# EAGLE design mono.stereo.mixer.noninv (EAGLE 9.6.2)
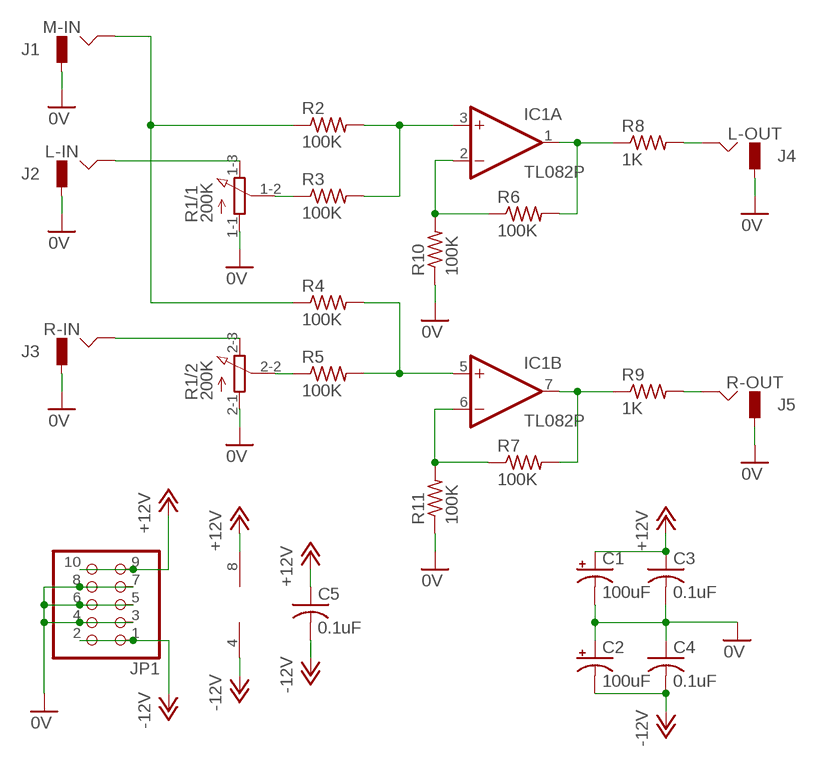
[diagram p0: schematic, sheet 1]

## Parts
C1  100uF  CPOL-USE2-5  [E2-5]
C2  100uF  CPOL-USE2-5  [E2-5]
C3  0.1uF  C-US025-024X044  [C025-024X044]
C4  0.1uF  C-US025-024X044  [C025-024X044]
C5  0.1uF  C-US025-024X044  [C025-024X044]
IC1  TL082P  [DIL08]
J1  M-IN  JACK-M  [JACK-M]
J2  L-IN  JACK-M  [JACK-M]
J3  R-IN  JACK-M  [JACK-M]
J4  L-OUT  JACK-M  [JACK-M]
J5  R-OUT  JACK-M  [JACK-M]
JP1  PINHD-2X5  [2X05]
R1  200K  3RP/1610G  [3RP/1610G]
R2  100K  R-US_0204/5  [0204/5]
R3  100K  R-US_0204/5  [0204/5]
R4  100K  R-US_0204/5  [0204/5]
R5  100K  R-US_0204/5  [0204/5]
R6  100K  R-US_0204/5  [0204/5]
R7  100K  R-US_0204/5  [0204/5]
R8  1K  R-US_0204/5  [0204/5]
R9  1K  R-US_0204/5  [0204/5]
R10  100K  R-US_0204/5  [0204/5]
R11  100K  R-US_0204/5  [0204/5]

## Nets
0V: C1.- C2.+ C3.2 C4.1 J1.GND J2.GND J3.GND J4.GND J5.GND JP1.3 JP1.4 JP1.5 JP1.6 JP1.7 JP1.8 R1.1-1(/1:A) R1.2-1(/2:A) R10.1 R11.1
+12V: C1.+ C3.1 C5.1 IC1.8(P:V+) JP1.9 JP1.10
-12V: C2.- C4.2 C5.2 IC1.4(P:V-) JP1.1 JP1.2
N$1: IC1.2(A:-IN) R6.1 R10.2
N$3: IC1.6(B:-IN) R7.1 R11.2
N$4: J1.HOT R2.1 R4.1
N$5: IC1.3(A:+IN) R2.2 R3.2
N$6: IC1.5(B:+IN) R4.2 R5.2
N$7: IC1.1(A:OUT) R6.2 R8.1
N$8: J4.HOT R8.2
N$9: IC1.7(B:OUT) R7.2 R9.1
N$10: J5.HOT R9.2
N$11: J2.HOT R1.1-3(/1:E)
N$12: J3.HOT R1.2-3(/2:E)
N$13: R1.2-2(/2:S) R5.1
N$14: R1.1-2(/1:S) R3.1

## Library data of the parts
C1 C2 = rcl:CPOL-US: POLARIZED CAPACITOR, American symbol; SPICEPREFIX: C
C3-C5 = rcl:C-US: CAPACITOR, American symbol; SPICEPREFIX: C
IC1 = linear:TL082: OP AMP Data sheet <http://www.ti.com/lit/ds/symlink/tl084a . pdf>; DATA_SHEET: <a href="http://www.ti.com/lit/ds/symlink/tl084a.pdf"> Data sheet </a>
J1-J5 = _common:JACK-M
JP1 = pinhead:PINHD-2X5: PIN HEADER
R1 = _common:3RP/1610G: Generic two level pot.
R2-R11 = rcl:R-US_: RESISTOR, American symbol; SPICEPREFIX: R

## Board
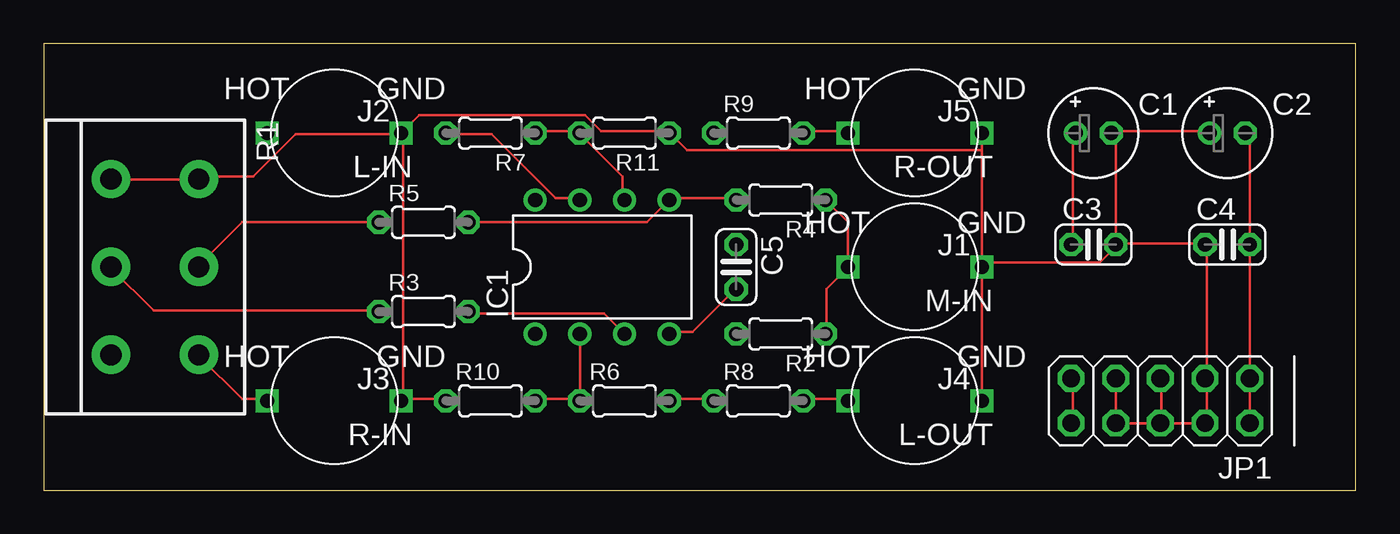
[diagram p1: board, top side]
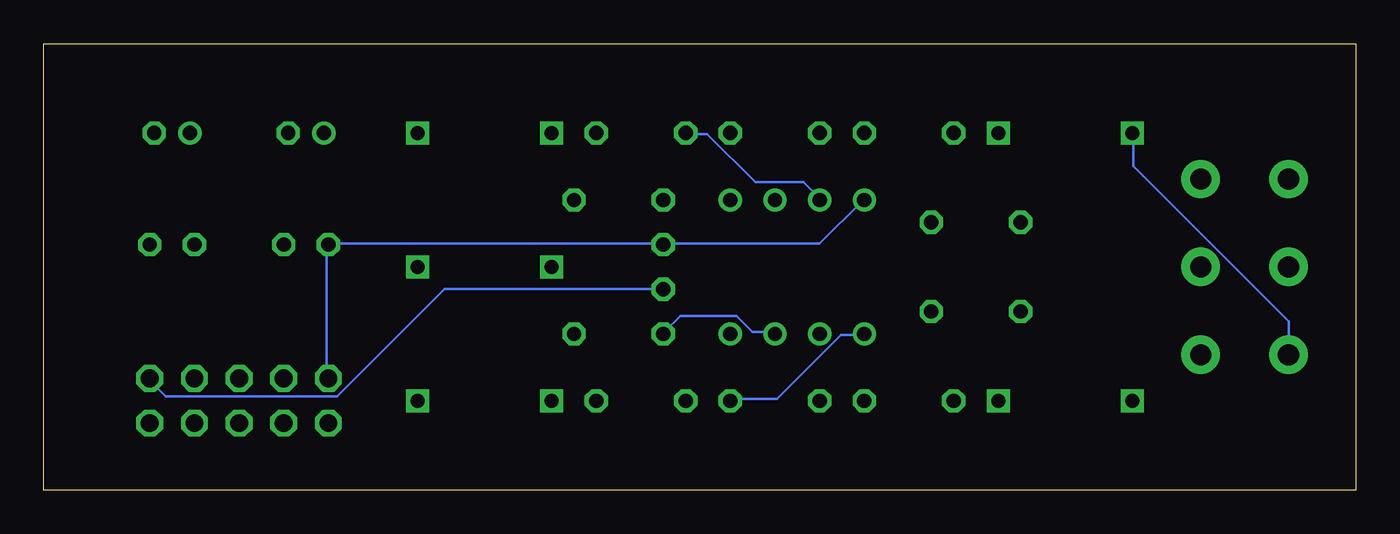
[diagram p2: board, bottom side, seen from below]

Size 74.6 x 25.39 mm. Coordinates in mm from the lower left corner, seen from the top.
Outline: 0,0 74.6,0 74.6,25.39 0,25.39 0,0
Copper layers (1*16): Top 0.035mm / dielectric 1.5mm / Bottom 0.035mm
Design rules "default": minimum track width 6mil, minimum drill 0.35mm, track to track 6mil, track to pad 6mil, pad to pad 6mil, via to via 6mil, smd to smd 6mil, copper to edge 40mil, drill to drill 6mil, minimum pad ring 10mil, minimum via ring 8mil, stop-mask expansion 4mil, vias tented up to drill 0mil, thermal gap 10mil

### Footprints (pad centres in the part's own frame; a part is rotated, then mirrored left to right if it is on the bottom)
E2-5 = drill 0.813 pad 1.27: + -1.016,0 | drill 0.813 pad 1.27 octagon: - 1.016,0
C025-024X044 = drill 0.813 octagon: 1 -1.27,0; 2 1.27,0
DIL08 = drill 0.813 pad 1.27: 1 -3.81,-3.81; 2 -1.27,-3.81; 3 1.27,-3.81; 4 3.81,-3.81; 5 3.81,3.81; 6 1.27,3.81; 7 -1.27,3.81; 8 -3.81,3.81
JACK-M = drill 0.8 square: GND -3.81,0; HOT 3.81,0
2X05 = drill 1.016 octagon: 1 -5.08,-1.27; 2 -5.08,1.27; 3 -2.54,-1.27; 4 -2.54,1.27; 5 0,-1.27; 6 0,1.27; 7 2.54,-1.27; 8 2.54,1.27; 9 5.08,-1.27; 10 5.08,1.27
3RP/1610G = drill 1.2 pad 2.184: 1-1 -5,0; 1-2 0,0; 1-3 5,0; 2-1 -5,5; 2-2 0,5; 2-3 5,5
0204/5 = drill 0.813 octagon: 1 -2.54,0; 2 2.54,0

### Placement (x,y rotation side)
C1  59.69,20.32 0 top
C2  67.31,20.32 0 top
C3  59.69,13.97 0 top
C4  67.31,13.97 0 top
C5  39.37,12.7 270 top
IC1  31.75,12.7 0 top
J1  49.53,12.7 180 top
J2  16.51,20.32 180 top
J3  16.51,5.08 180 top
J4  49.53,5.08 180 top
J5  49.53,20.32 180 top
JP1  63.5,5.08 180 top
R1  3.81,12.7 270 top
R2  41.91,8.89 180 top
R3  21.59,10.16 0 top
R4  41.91,16.51 180 top
R5  21.59,15.24 0 top
R6  33.02,5.08 0 top
R7  25.4,20.32 180 top
R8  40.64,5.08 0 top
R9  40.64,20.32 0 top
R10  25.4,5.08 0 top
R11  33.02,20.32 180 top

### Tracks (layer width: path | path; a pad name or v marks a point on that pad's centre or on a via)
0V
  Top 0.152: J1.GND J4.GND | J1.GND 53.34,12.95 | 53.34,12.95 53.34,19.36 | 53.34,19.36 J5.GND | JP1.7 JP1.8 JP1.6 63.55,3.81 | 63.55,3.81 63.55,6.25 JP1.5 | 63.55,3.81 JP1.4 66.14,3.81 66.14,6.25 JP1.3 66.14,6.4 66.14,13.87 C4.1 65.99,14.02 60.96,14.02 | 60.96,20.42 66.29,20.42 C2.+ | 60.96,20.42 60.81,20.42 C1.- 60.96,20.42 | 60.96,20.42 60.96,14.02 | 60.96,14.02 C3.2 60.96,13.87 60.05,12.95 53.34,12.95 | 53.34,12.8 J1.GND | 20.42,5.18 22.86,5.18 R10.1 | J2.GND 20.27,20.27 14.33,20.27 11.89,17.83 8.84,17.83 R1.2-1 8.69,17.68 3.81,17.68 R1.1-1 | J2.GND 21.34,21.34 30.79,21.34 31.7,20.42 35.51,20.42 R11.1 35.66,20.27 36.58,19.36 53.34,19.36 | 20.42,5.18 20.42,20.27 J2.GND | 20.42,5.18 J3.GND
+12V
  Top 0.152: JP1.10 58.52,3.81 58.52,6.25 JP1.9 | C3.1 58.52,14.02 58.52,20.12 58.67,20.27 C1.+
  Bottom 0.152: IC1.8 28.04,16.46 30.48,14.02 39.32,14.02 C5.1 39.47,14.02 58.37,14.02 C3.1 58.52,13.87 58.52,6.4 JP1.9
-12V
  Top 0.152: IC1.4 35.66,8.99 36.88,8.99 39.32,11.43 C5.2 | JP1.2 JP1.1 C4.2 68.58,20.12 68.43,20.27 C2.-
  Bottom 0.152: C5.2 51.82,11.43 57.91,5.33 67.67,5.33 68.58,6.25 JP1.1
N$1
  Top 0.152: 30.48,5.18 28.04,5.18 R10.2 | 30.48,5.18 IC1.2 | 30.48,5.18 R6.1
N$3
  Top 0.152: R7.1 28.04,20.42 30.48,20.42 R11.2 30.48,20.27 32.92,17.83 32.92,16.61 IC1.6
N$4
  Top 0.152: R4.1 45.72,15.24 J1.HOT 45.72,12.65 44.5,11.43 44.5,8.99 R2.1
N$5
  Top 0.152: IC1.3 31.85,10.06 24.23,10.06 R3.2
  Bottom 0.152: IC1.3 33.07,8.99 34.29,8.99 35.2,9.91 38.41,9.91 39.32,8.99 R2.2
N$6
  Top 0.152: R5.2 34.29,15.24 IC1.5 35.66,16.61 39.32,16.61 R4.2
N$7
  Top 0.152: R6.2 35.66,5.18 38.1,5.18 R8.1
  Bottom 0.152: IC1.1 28.04,8.84 29.26,8.84 32.92,5.18 35.51,5.18 R6.2
N$8
  Top 0.152: J4.HOT 45.72,5.18 43.28,5.18 R8.2
N$9
  Top 0.152: IC1.7 30.48,16.61 29.11,16.61 25.45,20.27 22.86,20.27 R7.2
  Bottom 0.152: R9.1 38.1,20.27 36.88,20.27 34.14,17.53 31.39,17.53 30.48,16.61 IC1.7
N$10
  Top 0.152: J5.HOT 45.72,20.42 43.28,20.42 R9.2
N$11
  Bottom 0.152: R1.1-3 3.81,9.6 12.65,18.44 12.65,20.27 J2.HOT
N$12
  Top 0.152: J3.HOT 12.65,5.18 11.28,5.18 8.84,7.62 R1.2-3
N$13
  Top 0.152: R5.1 11.28,15.24 8.84,12.8 R1.2-2
N$14
  Top 0.152: R3.1 19.05,10.21 6.25,10.21 3.81,12.65 R1.1-2